# Altium schematic sheet Sheet_HTN.SchDoc
size A; SheetNumber: 1; SheetTotal: 1
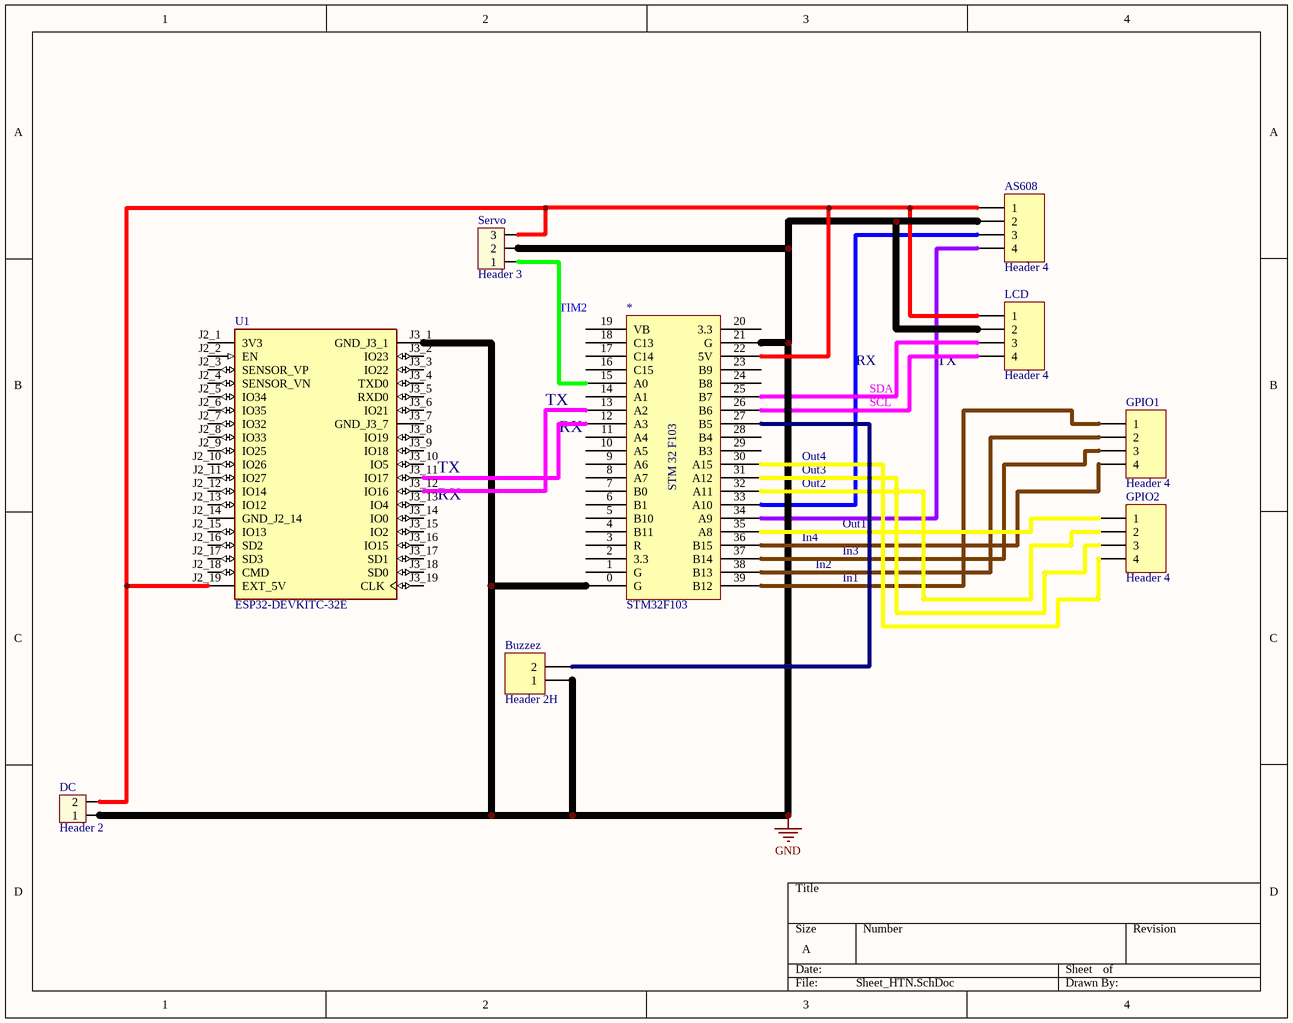
[diagram p0: Sheet_HTN.SchDoc]

## Parts
*  STM32F103  [STM32F103]
AS608  Header 4  [HDR1X4]
Buzzez  Header 2H  [HDR1X2H]
DC  Header 2  [HED2]
GPIO1  Header 4  [HDR1X4]
GPIO2  Header 4  [HDR1X4]
LCD  Header 4  [HDR1X4]
Servo  Header 3  [HED3]
U1  ESP32-DEVKITC-32E  [MODULE_ESP32-DEVKITC-32E]

## Nets
GND: *.0(G) *.21(G) AS608.2 Buzzez.1 DC.1 LCD.2 Servo.2 U1.J3_1(GND_J3_1)
Net*_12: *.12(A3) U1.J3_11(IO17)
Net*_13: *.13(A2) U1.J3_12(IO16)
Net*_15: *.15(A0) Servo.1
Net*_22: *.22(5V) AS608.1 DC.2 LCD.1 Servo.3 U1.J2_19(EXT_5V)
Net*_25: *.25(B7) LCD.3
Net*_26: *.26(B6) LCD.4
Net*_27: *.27(B5) Buzzez.2
Net*_30: *.30(A15) GPIO2.4
Net*_31: *.31(A12) GPIO2.3
Net*_32: *.32(A11) GPIO2.2
Net*_33: *.33(A10) AS608.3
Net*_34: *.34(A9) AS608.4
Net*_35: *.35(A8) GPIO2.1
Net*_36: *.36(B15) GPIO1.4
Net*_37: *.37(B14) GPIO1.3
Net*_38: *.38(B13) GPIO1.2
Net*_39: *.39(B12) GPIO1.1

Not connected (* = marked no-connect by the designer): * 1(G) 2(3.3) 3(R) 4(B11) 5(B10) 6(B1) 7(B0) 8(A7) 9(A6) 10(A5) 11(A4) 14(A1) 16(C15) 17(C14) 18(C13) 19(VB) 20(3.3) 23(B9) 24(B8) 28(B4) 29(B3); U1 J2_1(3V3) J2_2(EN) J2_3(SENSOR_VP) J2_4(SENSOR_VN) J2_5(IO34) J2_6(IO35) J2_7(IO32) J2_8(IO33) J2_9(IO25) J2_10(IO26) J2_11(IO27) J2_12(IO14) J2_13(IO12) J2_14(GND_J2_14) J2_15(IO13) J2_16(SD2) J2_17(SD3) J2_18(CMD) J3_2(IO23) J3_3(IO22) J3_4(TXD0) J3_5(RXD0) J3_6(IO21) J3_7(GND_J3_7) J3_8(IO19) J3_9(IO18) J3_10(IO5) J3_13(IO4) J3_14(IO0) J3_15(IO2) J3_16(IO15) J3_17(SD1) J3_18(SD0) J3_19(CLK)

## Notes on the sheet
- TIM2
- RX
- (near LCD) TX
- TX
- (near *) RX
- SDA
- SCL
- (near U1) TX
- (near U1) RX
- Out2
- Out3
- Out4
- In4
- In2
- Out1
- In3
- In1
- (in symbol STM32F103) STM 32 F103

## Library data of the parts
AS608 GPIO1 GPIO2 LCD = Header 4: Header, 4-Pin; LatestRevisionDate: 17-Jul-2002; LatestRevisionNote: Re-released for DXP Platform.; Publisher: Altium Limited
Buzzez = Header 2H: Header, 2-Pin, Right Angle; LatestRevisionDate: 17-Jul-2002; LatestRevisionNote: Re-released for DXP Platform.; Publisher: Altium Limited
DC = Hed2: Header 2 (Green); Value: Header 2
Servo = Hed3: Header 3 (Green); Value: Header 3
U1 = ESP32-DEVKITC-32E: The ESP32-DEVKITC-32E transceiver evaluation board from Espressif Systems is a powerful development tool for wireless communication technologies. It supports 802.11 b/g/n Wi-Fi and BluetoothÂ® Smart Ready 4.x (BLE) dual-mode at 2.4GHz, making it ideal for; SnapEDA_Link: https://www.snapeda.com/parts/ESP32-DEVKITC-32E/Espressif+Systems/view-part/?ref=snap; Package: None; Value: *; MF: Espressif Systems; MP: ESP32-DEVKITC-32E; Check_prices: https://www.snapeda.com/parts/ESP32-DEVKITC-32E/Espressif+Systems/view-part/?ref=eda